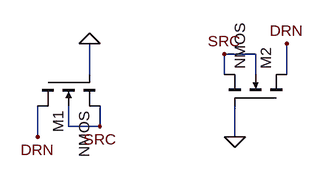
[diagram p0: schematic nmos4_mirrored_quarter_turns.asc]
nmos4_mirrored_quarter_turns.asc, the LTspice schematic file:
Version 4
SHEET 1 880 680
WIRE 224 16 224 64
WIRE 528 16 528 64
WIRE 432 32 432 64
WIRE 480 32 432 32
WIRE 480 32 480 64
WIRE 144 112 144 160
WIRE 192 144 192 112
WIRE 240 144 192 144
WIRE 240 144 240 112
WIRE 448 112 448 160
FLAG 224 16 0
FLAG 528 16 DRN
FLAG 432 32 SRC
FLAG 144 160 DRN
FLAG 240 144 SRC
FLAG 448 160 0
SYMBOL nmos4 144 64 M90
SYMATTR InstName M1
SYMBOL nmos4 528 112 M270
SYMATTR InstName M2

The netlist it stands for:
* nmos4_mirrored_quarter_turns.asc
M1 DRN 0 SRC SRC NMOS
M2 DRN 0 SRC SRC NMOS
.model NMOS NMOS
.model PMOS PMOS
.lib standard.mos
.backanno
.end